# Altium schematic sheet Power_IN.SchDoc: Power in
size A; DocumentNumber: 01; SheetNumber: 3; SheetTotal: 7
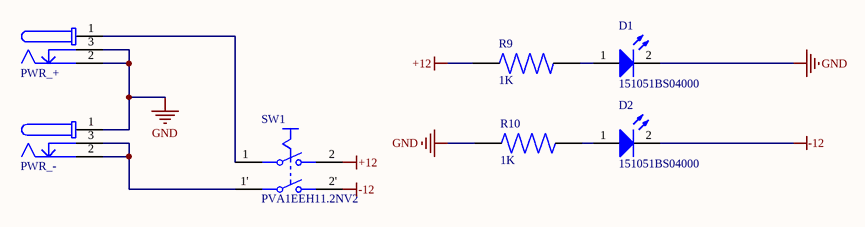
[diagram p0: Power_IN.SchDoc]

## Parts
D1  151051BS04000  [WL-TMRC_D5.9H8.7]
D2  151051BS04000  [WL-TMRC_D5.9H8.7]
PWR_+  694106301002  [PCBComponent_1]  (value not drawn)
PWR_-  694106301002  [PCBComponent_1]  (value not drawn)
R9  1K  [RESAD1100W55L680D260]
R10  1K  [RESAD1100W55L680D260]
SW1  PVA1EEH11.2NV2  [FP-PVA1EEH11_2NV2-MFG]

## Nets
+12: R9.1 SW1.2
-12: D2.2(K) SW1.2'
GND: D1.2(K) PWR_+.2 PWR_+.3 PWR_-.1 R10.1
NetD1_1: D1.1(A) R9.2
NetD2_1: D2.1(A) R10.2
NetPWR_+_1: PWR_+.1 SW1.1
NetPWR_-_2: PWR_-.2 PWR_-.3 SW1.1'

## Library data of the parts
D1 D2 = CMP-1488-00009-2: NexarPartId: 29717812; Test Current: 20mA; Forward Voltage: 3.2V; Wavelength: 470nm; Lens Size: 5mm; Lens Style: Circular, Diffused, Round; Forward Current: 100mA; Peak Wavelength: 465nm; Viewing Angle: 40°; Luminous Intensity: 500mcd; Max Reverse Voltage (DC): 5V; Color: Blue; Case/Package: Radial; Width: 5mm; Mount: Through Hole; Min Operating Temperature: -40°C; Length: 5mm; Height: 8.6mm; Max Operating Temperature: 85°C; Packaging: Bulk; RoHS: Compliant; REACH SVHC: Unknown; Dominant Wavelength: 470nm
PWR_+ PWR_- = 694106301002: DC Power Jack Connector WR-DC, Male, Right Angled, THT, 5 A, 24 V; Manufacturer: Wurth Elektronik; Current Rating: 5A; Insulation Resistance: 100MΩ; Number of Contacts: 3; Operating Supply Voltage: 24V; Shielding: Unshielded; Supplier: DigiKey; Supplier Part Number: 732-5930-ND; Manufacturer Part Number: 694106301002; RoHS: Compliant; Category: Power Connectors; Stock: 67461; Pricing: 1=0.92, 10=0.873, 50=0.774, 100=0.72, 500=0.621, 1000=0.531 (USD); Color: Black; Connector Type: Power; Contact Gender: Female; Contact Material: Gold, Tin; Contact Plating: Tin; Flammability Rating: UL94 V-0; Gender: Male; Height: 11mm; Housing Material: Polyamide; Max Operating Temperature: 85°C; Min Operating Temperature: -40°C; Mounting Technology: Through Hole; Packaging: Bulk; REACH SVHC: Unknown; Termination: Through Hole; Voltage Rating: 24V; ComponentLink1URL: https://datasheet.octopart.com:443/694106301002-W%C3%BCrth-Elektronik-datasheet-111088219.pdf?src-supplier=Newark; ComponentLink1Description: https://datasheet.octopart.com:443/694106301002-W%C3%BCrth-Elektronik-datasheet-111088219.pdf?src-supplier=Newark; ComponentLink2URL: https://datasheet.octopart.com:443/694106301002-W%C3%BCrth-Elektronik-datasheet-38737356.pdf?src-supplier=Farnell; ComponentLink2Description: https://datasheet.octopart.com:443/694106301002-W%C3%BCrth-Elektronik-datasheet-38737356.pdf?src-supplier=Farnell; ComponentLink3URL: https://datasheet.octopart.com:443/694106301002-W%C3%BCrth-Elektronik-datasheet-66582004.pdf?src-supplier=Farnell; ComponentLink3Description: https://datasheet.octopart.com:443/694106301002-W%C3%BCrth-Elektronik-datasheet-66582004.pdf?src-supplier=Farnell
R9 R10 = MFR-25FBF52-1K: 1.07 kOhms Â±1% 0.25W, 1/4W Through Hole Resistor Axial - Metal Film; MF: Yageo; SnapEDA_Link: https://www.snapeda.com/parts/MFR-25FBF52-1K/Yageo/view-part/?ref=snap; Package: RADIAL-2 YAGEO; Value: *; MP: MFR-25FBF52-1K; Check_prices: https://www.snapeda.com/parts/MFR-25FBF52-1K/Yageo/view-part/?ref=eda
SW1 = CMP-10035-000009-1: SWITCH PUSH DPST 0.1A 32V; Switch Function: Off-On; Current Rating: 100mA; Electrical Life: 100000Cycles; RoHS Compliant: Yes; Throw Configuration: DPST; Max Operating Temperature: 85°C; Voltage Rating (DC): 32V; Mount: Through Hole; Series: PVA; Min Operating Temperature: -40°C; Termination: PC Pin; Packaging: Bulk